# Altium schematic sheet Ethernet.SchDoc
size A4; SheetNumber: 7; SheetTotal: 7
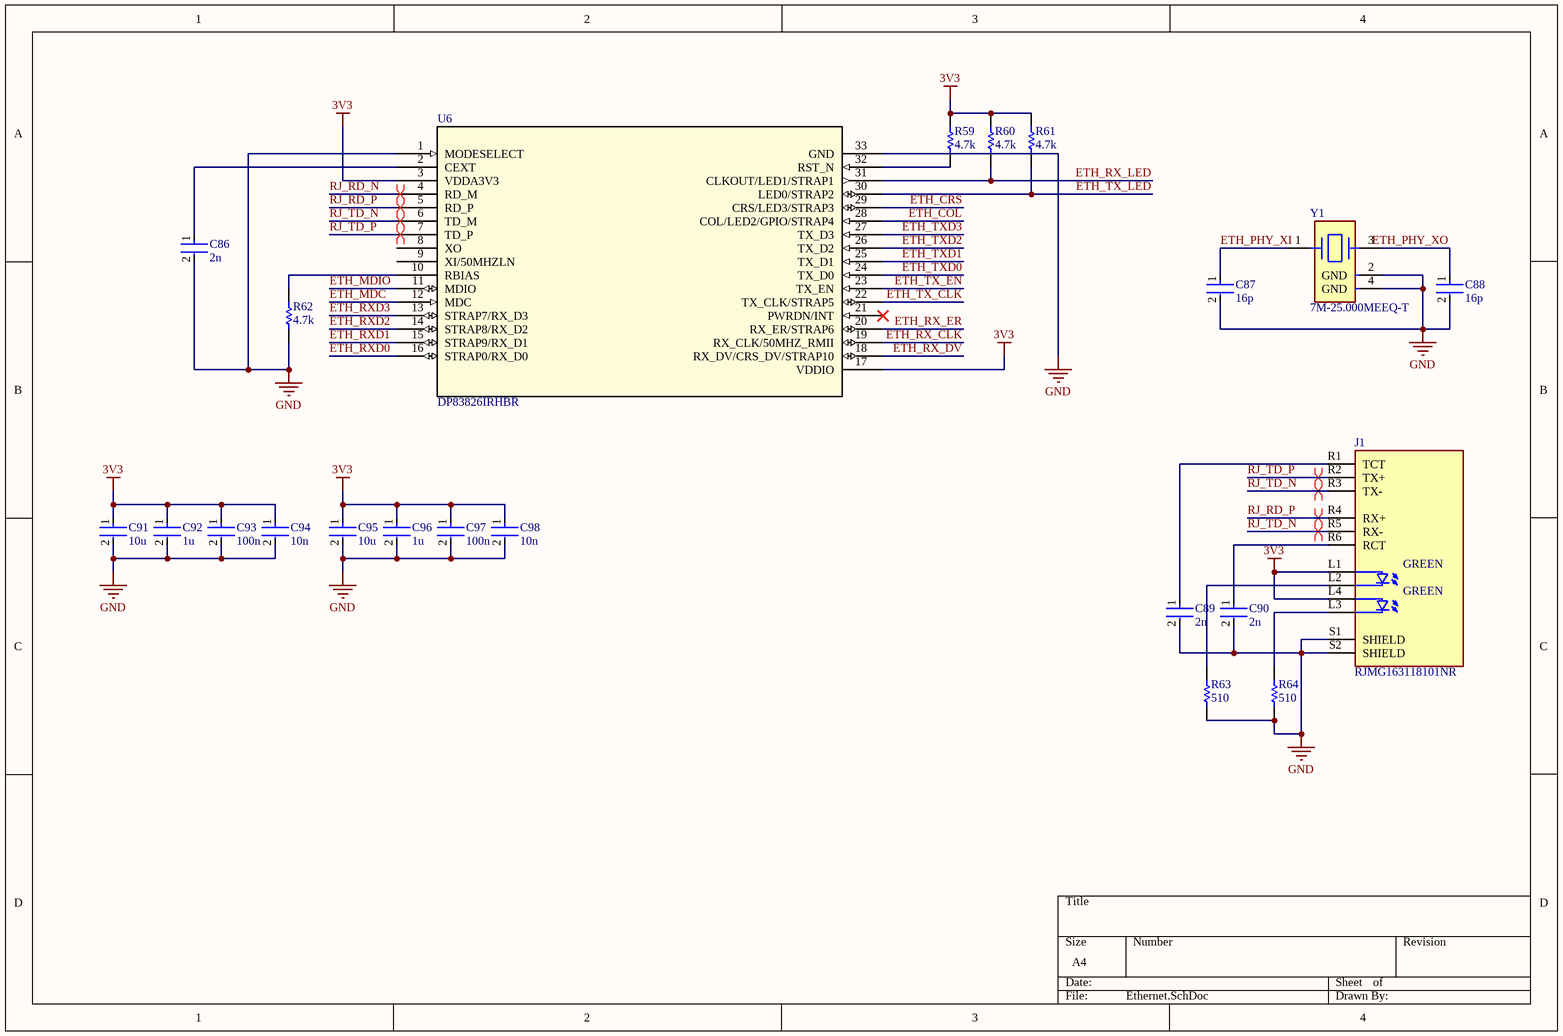
[diagram p0: Ethernet.SchDoc]

## Parts
C86  2n  [FP-C0603C-CF-MFG]
C87  16p  [FP-C0603C-CF-MFG]
C88  16p  [FP-C0603C-CF-MFG]
C89  2n  [FP-C0603C-CF-MFG]
C90  2n  [FP-C0603C-CF-MFG]
C91  10u  [FP-CC0805-0_85-MFG]
C92  1u  [FP-CC0805-0_85-MFG]
C93  100n  [FP-C0603C-CF-MFG]
C94  10n  [FP-C0603C-CF-MFG]
C95  10u  [FP-CC0805-0_85-MFG]
C96  1u  [FP-CC0805-0_85-MFG]
C97  100n  [FP-C0603C-CF-MFG]
C98  10n  [FP-C0603C-CF-MFG]
J1  RJMG163118101NR  [AMPHENOL_RJMG163118101NR]
R59  4.7k  [RESC1609X50X30NL8T20]
R60  4.7k  [RESC1609X50X30NL8T20]
R61  4.7k  [RESC1609X50X30NL8T20]
R62  4.7k  [RESC1609X50X30NL8T20]
R63  510  [RESC1609X50X30NL8T20]
R64  510  [RESC1609X50X30NL8T20]
U6  DP83826IRHBR  [VQFN32_RHB_TEX]
Y1  7M-25.000MEEQ-T  [FP-7M-MFG]

## Nets
3V3: C91.1 C92.1 C93.1 C94.1 C95.1 C96.1 C97.1 C98.1 J1.L1(LED1+) J1.L4(LED2+) R59.2 R60.2 R61.2 U6.3(VDDA3V3) U6.17(VDDIO)
GND: C86.2 C87.2 C88.2 C89.2 C90.2 C91.2 C92.2 C93.2 C94.2 C95.2 C96.2 C97.2 C98.2 J1.S1(SHIELD) J1.S2(SHIELD) R62.1 R63.1 R64.1 U6.1(MODESELECT) U6.33(GND) Y1.2(GND) Y1.4(GND)
ETH_COL: U6.28(COL/LED2/GPIO/STRAP4)
ETH_CRS: U6.29(CRS/LED3/STRAP3)
ETH_MDC: U6.12(MDC)
ETH_MDIO: U6.11(MDIO)
ETH_PHY_XI: C87.1 Y1.1
ETH_PHY_XO: C88.1 Y1.3
ETH_RX_CLK: U6.19(RX_CLK/50MHZ_RMII)
ETH_RX_DV: U6.18(RX_DV/CRS_DV/STRAP10)
ETH_RX_ER: U6.20(RX_ER/STRAP6)
ETH_RX_LED: R60.1 U6.31(CLKOUT/LED1/STRAP1)
ETH_RXD0: U6.16(STRAP0/RX_D0)
ETH_RXD1: U6.15(STRAP9/RX_D1)
ETH_RXD2: U6.14(STRAP8/RX_D2)
ETH_RXD3: U6.13(STRAP7/RX_D3)
ETH_TX_CLK: U6.22(TX_CLK/STRAP5)
ETH_TX_EN: U6.23(TX_EN)
ETH_TX_LED: R61.1 U6.30(LED0/STRAP2)
ETH_TXD0: U6.24(TX_D0)
ETH_TXD1: U6.25(TX_D1)
ETH_TXD2: U6.26(TX_D2)
ETH_TXD3: U6.27(TX_D3)
RJ_RD_N: U6.4(RD_M)
RJ_RD_P: J1.R4(RX+) U6.5(RD_P)
RJ_TD_N: J1.R3(TX-) J1.R5(RX-) U6.6(TD_M)
RJ_TD_P: J1.R2(TX+) U6.7(TD_P)
NetC86_1: C86.1 U6.2(CEXT)
NetC89_1: C89.1 J1.R1(TCT)
NetC90_1: C90.1 J1.R6(RCT)
NetJ1_L2: J1.L2(LED1-) R63.2
NetJ1_L3: J1.L3(LED2-) R64.2
NetR59_1: R59.1 U6.32(RST_N)
NetR62_2: R62.2 U6.10(RBIAS)

Not connected (* = marked no-connect by the designer): U6 8(XO) 9(XI/50MHZLN) 21(PWRDN/INT)*

## Layout directives
differential pair: RJ_RD_N, RJ_RD_P, RJ_TD_N, RJ_TD_P

## Notes on the sheet
- (in symbol RJMG163118101NR) GREEN

## Library data of the parts
C86-C90 C93 C94 C97 C98 = CMP-2006-03061-2: CAP CER 0.1UF 50V X7R 0603; Manufacturer: KEMET; Manufacturer Part Number: C0603C104K5RACTU; Tolerance: 0.1; Temperature Coefficient: 30ppm/°C; Material: Ceramic; Automotive Grade: Grade 1; Value: 0.10 μF; Temperature: -55°C to +125°C; RoHS: TRUE; Temperature Range High: +125°C; Lead Free: Yes; Octopart: https://octopart.com/c0603c104k5ractu-kemet-139244; Digikey Description: CAP CER 0.1UF 50V X7R 0603; Category: Cap; Package: C0603C-CF; ComponentLink2Description: Datasheet; Temperature Range Low: -55°C; Device Class L1: Passive Components; Voltage Rating: 50 V; Automotive: Yes; Device Class L3: Ceramic Capacitors; ComponentLink2URL: https://api.kemet.com/component-edge/download/datasheet/C0603C100J5GACAUTO.pdf; Capacitance: 0.10 μF; Device Class L2: Capacitors; Temperature Characteristic: X7R; Height: 0.87mm
C91 C92 C95 C96 = CMP-2100-03606-3: CAP CER 0.1UF 50V X7R 0805; Manufacturer Part Number: CC0805KRX7R9BB104; Manufacturer: Yageo; Tolerance: 0.1; Capacitance: 100 nF; Value: 100 nF; Material: Ceramic; Device Class L1: Passive Components; ComponentLink2Description: Datasheet; Package: CC0805-0.85; Digikey Description: CAP CER 0.1UF 50V X7R 0805; Device Class L3: Ceramic Capacitors; Temperature: -30°C to +85°C; Temperature Characteristic: X7R; Voltage Rating: 50 V; Height: 0.95mm; RoHS: TRUE; Ipc Land Pattern Name: CAPC200125X85; Device Class L2: Capacitors; Category: Cap; Temperature Range Low: -30°C; Temperature Range High: +85°C; Mouser Description: Multilayer Ceramic Capacitors MLCC - SMD/SMT 100nF 50V X7R 10%; Footprint Url: http://www.yageo.com/exep/pages/download/literatures/UPY-C_GEN_24.pdf; Automotive: No; Octopart: https://octopart.com/cc0805krx7r9bb104-yageo-192993; Lead Free: Yes; ComponentLink2URL: http://www.yageo.com/documents/recent/UPY-GPHC_Y5V_6.3V-to-50V_8.pdf
R59-R64 = CMP-1666-00005-4: Chip Resistor, 10 KOhm, +/- 1%, 100 mW, -55 to 155 degC, 0603 (1608 Metric), RoHS, Tape and Reel; Manufacturer: Vishay Semiconductor; Voltage Rating: 75 V; Max Operating Temperature: 155 degC; PackageDescription: 2-Pin Surface Mount Device, Body 1.575 x 0.85 mm; ComponentLink1Description: Manufacturer URL; RoHSCompliant: true; PackageReference: 0603; REACH SVHC: Unknown; Length: 1.55 mm; DatasheetVersion: 06/2012; Packaging: Tape and Reel; Min Operating Temperature: -55 degC; Mounting Technology: Surface Mount; ComponentLink2URL: https://datasheet.ciiva.com/11809/0900766b80d98afc-11809037.pdf; Height: 0.45 mm; ComponentLink2Description: Datasheet; Package Quantity: 5000; ComponentLink1URL: http://www.vishay.com/
U6 = DP83826IRHBR: No Description Available; Mfr_Name: Texas Instruments; RefDes: RefDes; Type: Type
Y1 = CMP-18717-000310-1: Crystal 25MHz, 10ppm, 10pF, 50Ω; ESR (Equivalent Series Resistance): 60R; Package Quantity: 3000; Frequency: 25MHz; Width: 0.098inch; Depth: 2.5mm; Series: 7M; Case/Package: SMD/SMT; Min Operating Temperature: -20°C; Frequency Stability: 10ppm; Termination: SMD/SMT; Max Operating Temperature: 70°C; REACH SVHC: No SVHC; Length: 3.2mm; Number of Pins: 4; Frequency Tolerance: 10ppm; Mount: Surface Mount; Tolerance: 10ppm; Height: 0.031inch; Load Capacitance: 10pF; Packaging: Tape and Reel
J1 = RJMG163118101NR: Price: None; Availability: Unavailable; Value: *; MP: RJMG163118101NR; Package: None